# EAGLE design bonnie (EAGLE 7.6.0)
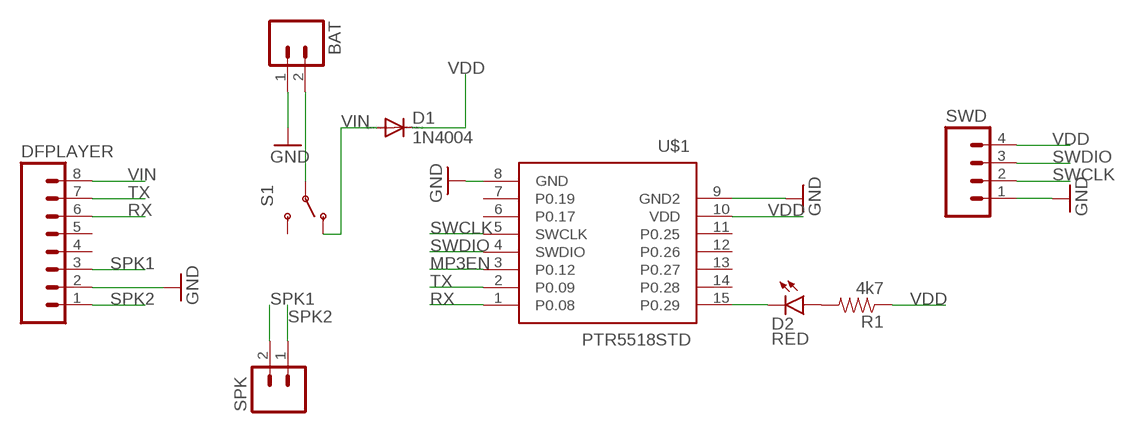
[diagram p0: schematic, sheet 1]

## Parts
BAT  M02JST-PTH-2  [JST-2-PTH]
D1  1N4004  [DO41-10]
D2  RED  LED-RED1206  [LED-1206]
DFPLAYER  M08LOCK  [1X08_LOCK]
R1  4k7  4.7OHM-1/10W-5%(0603)  [0603-RES]
S1  SWITCH-SPDTPTH  [SWITCH-SPDT]
SPK  M02JST-PTH-2  [JST-2-PTH]
SWD  M04LOCK  [1X04_LOCK]
U$1  PTR5518STD  [PTR5518]

## Nets
GND: BAT.1 DFPLAYER.2 SWD.1 U$1.8(GND) U$1.9(GND2)
MP3EN: U$1.3(P0.12)
N$1: BAT.2 S1.2(P)
N$2: D2.A R1.2
N$3: D2.C U$1.15(P0.29)
RX: DFPLAYER.6 U$1.1(P0.08)
SPK1: DFPLAYER.3 SPK.2
SPK2: DFPLAYER.1 SPK.1
SWCLK: SWD.2 U$1.5(SWCLK)
SWDIO: SWD.3 U$1.4(SWDIO)
TX: DFPLAYER.7 U$1.2(P0.09)
VDD: D1.C R1.1 SWD.4 U$1.10(VDD)
VIN: D1.A DFPLAYER.8 S1.1(O)
Unconnected: DFPLAYER.4 DFPLAYER.5 S1.3(S) U$1.6(P0.17) U$1.7(P0.19) U$1.11(P0.25) U$1.12(P0.26) U$1.13(P0.27) U$1.14(P0.28)

## Library data of the parts
BAT SPK = SparkFun-Connectors:M02: Standard 2-pin 0.1" header. Use with - straight break away headers ( PRT-00116) - right angle break away headers (PRT-00553) - swiss pins (PRT-00743) - machine pins (PRT-00117) - female headers (PRT-00115) Molex polarized connector foot print use with: PRT-08233 with associated crimp pins and housings. 2.54_SCREWTERM for use with PRT-10571. 3.5mm Screw Terminal footprints for PRT-08084 5mm Screw Terminal footprints for use with PRT-08432; PROD_ID: CONN-09863; SKU: PRT-09914
D1 = diode:1N4004: DIODE general purpose rectifier, 1 A
D2 = SparkFun-LED:LED-RED: Assorted Red LEDs LilyPad 1206- DIO-09912 1206- DIO-00809 0603- DIO-00819 "SMART" means more efficient and expensive; PROD_ID: DIO-09912
DFPLAYER = SparkFun-Connectors:M08: Header 8 Standard 8-pin 0.1" header. Use with straight break away headers (SKU : PRT-00116), right angle break away headers (PRT-00553), swiss pins (PRT-00743), machine pins (PRT-00117), and female headers (PRT-00115).
R1 = SparkFun-Resistors:4.7OHM-1/10W-5%(0603): RES-08295; PROD_ID: RES-08295
S1 = SparkFun-Electromechanical:SWITCH-SPDT: SPDT Switch Simple slide switch, Spark Fun Electronics SKU : COM-00102 DPDT SMT slide switch, AYZ0202, SWCH-08179; PROD_ID: SWCH-08261
SWD = SparkFun-Connectors:M04: Header 4 Standard 4-pin 0.1" header. Use with straight break away headers (SKU : PRT-00116), right angle break away headers (PRT-00553), swiss pins (PRT-00743), machine pins (PRT-00117), and female headers (PRT-00115). Molex polarized connector foot print use with SKU : PRT-08231 with associated crimp pins and housings. 1MM SMD Version SKU: PRT-10208; PROD_ID: CONN-09696
U$1 = PTR5518:PTR5518: nRF51822-based breakout board

## Board
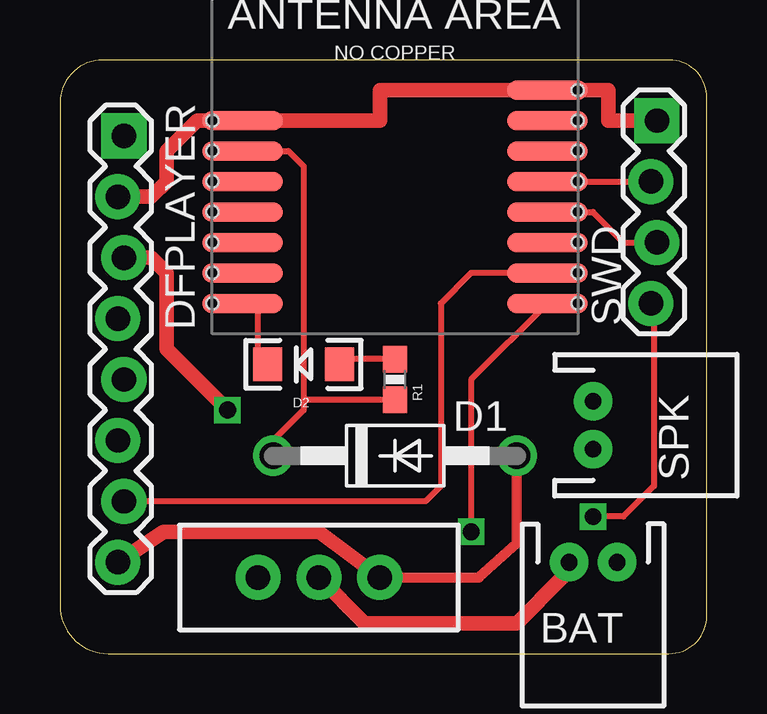
[diagram p1: board, top side]
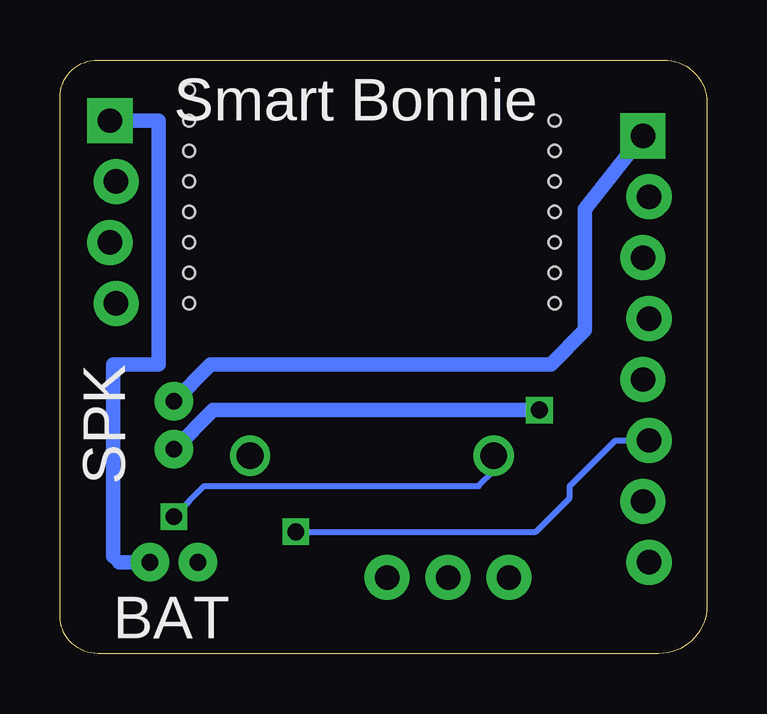
[diagram p2: board, bottom side, seen from below]

Size 26.98 x 24.75 mm. Coordinates in mm from the lower left corner, seen from the top.
Outline: 26.98,1.58 26.98,23.18 arc90 25.4,24.75 1.79,24.75 arc90 0,22.97 0,2.01 arc90 2.01,0 25.39,0 arc90 26.98,1.58
Copper layers (1*16): Top 0.035mm / dielectric 1.5mm / Bottom 0.035mm
Design rules "default": minimum track width 10mil, minimum drill 24mil, track to track 8mil, track to pad 8mil, pad to pad 8mil, via to via 8mil, smd to smd 8mil, copper to edge 40mil, drill to drill 8mil, minimum pad ring 10mil, minimum via ring 8mil, stop-mask expansion 4mil, vias tented up to drill 0mil, thermal gap 10mil

### Footprints (pad centres in the part's own frame; a part is rotated, then mirrored left to right if it is on the bottom)
JST-2-PTH = drill 0.7 pad 1.6: 1 -1,0; 2 1,0
DO41-10 = drill 1.118: A 5.08,0; C -5.08,0
LED-1206 = smd 1.2 x 1.4: A -1.5,0; C 1.5,0
1X08_LOCK = drill 1.016 pad 1.88 square: 1 0,0.127 | drill 1.016 pad 1.88: 2 2.54,-0.127; 3 5.08,0.127; 4 7.62,-0.127; 5 10.16,0.127; 6 12.7,-0.127; 7 15.24,0.127; 8 17.78,-0.127
0603-RES = smd 1.1 x 1: 1 -0.85,0; 2 0.85,0
SWITCH-SPDT = drill 1.016 pad 1.88: 1 0,2.54; 2 0,0; 3 0,-2.54
1X04_LOCK = drill 1.016 pad 1.88 square: 1 0,0.127 | drill 1.016 pad 1.88: 2 2.54,-0.127; 3 5.08,0.127; 4 7.62,-0.127
PTR5518 = smd 3.353 x 0.813: 1 6.35,-6.35; 2 6.35,-5.08; 3 6.35,-3.81; 4 6.35,-2.54; 5 6.35,-1.27; 6 6.35,0; 7 6.35,1.27; 8 6.35,2.54; 9 -6.35,1.27; 10 -6.35,0; 11 -6.35,-1.27; 12 -6.35,-2.54; 13 -6.35,-3.81; 14 -6.35,-5.08; 15 -6.35,-6.35 | hole 0.5: -7.62,1.27; -7.62,0; -7.62,-1.27; -7.62,-2.54; -7.62,-3.81; -7.62,-5.08; -7.62,-6.35; 7.62,2.54; 7.62,1.27; 7.62,0; 7.62,-1.27; 7.62,-2.54; 7.62,-3.81; 7.62,-5.08; 7.62,-6.35

### Placement (x,y rotation side)
BAT  22.23,3.81 180 top
D1  13.97,8.25 0 top
D2  10.16,12.07 180 top
DFPLAYER  2.54,21.59 270 top
R1  13.97,11.43 90 top
S1  10.8,3.18 270 top
SPK  22.23,9.53 270 top
SWD  24.77,22.22 270 top
U$1  13.97,20.96 0 top

### Tracks (layer width: path | path; a pad name or v marks a point on that pad's centre or on a via)
GND
  Top 0.61: SWD.1 22.86,22.22 22.86,23.5 U$1.8 13.34,23.5 13.34,22.22 U$1.9 5.71,22.22 4.45,20.96 4.45,19.68 3.81,19.05 DFPLAYER.2
  Bottom 0.406: 24.51,3.81 arc90 24.77,4.06
  Bottom 0.61: BAT.1 24.51,3.81 | 24.77,4.06 24.77,12.07 22.86,12.07 22.86,22.22 SWD.1
N$1
  Top 0.406: BAT.2 20.95,3.18
  Top 0.61: 20.95,3.18 19.05,1.27 12.7,1.27 S1.2
N$2
  Top 0.254: R1.2 11.66,12.28 D2.A
N$3
  Top 0.254: D2.C 8.26,12.07 8.26,14.61 U$1.15
RX  (via drill 0.7)
  Top 0.254: U$1.1 17.14,11.43 v17.14,5.08
  Bottom 0.254: v17.14,5.08 7.13,5.08 5.71,6.5 5.71,6.99 3.81,8.89 DFPLAYER.6
SPK1  (via drill 0.7)
  Top 0.61: v6.98,10.16 4.45,12.7 4.45,15.88 3.81,16.51 DFPLAYER.3
  Bottom 0.61: SPK.2 20.59,10.16 v6.98,10.16
SPK2
  Bottom 0.61: DFPLAYER.1 5.08,18.54 5.08,13.49 6.5,12.07 20.69,12.07 SPK.1
SWCLK
  Top 0.254: U$1.5 SWD.2
SWDIO
  Top 0.254: U$1.4 22.23,18.42 23.49,17.14 SWD.3
TX
  Top 0.254: U$1.2 17.14,15.88 15.88,14.61 15.88,6.99 15.24,6.35 DFPLAYER.7
VDD  (via drill 0.7)
  Top 0.254: U$1.10 9.52,20.96 10.16,20.32 10.16,10.58 | D1.C 8.89,8.89 10.16,10.16 10.16,10.58 | SWD.4 24.77,14.48 24.77,6.99 23.49,5.71 v22.23,5.71 | R1.1 10.16,10.58
  Bottom 0.254: v22.23,5.71 20.95,6.99 9.52,6.99 8.89,7.62 D1.C
VIN
  Top 0.406: S1.1 17.47,3.18 19.05,4.6 D1.A
  Top 0.61: DFPLAYER.8 4.32,5.08 10.8,5.08 S1.1

### Text on the board
bNames: Smart Bonnie | SPK | BAT